# EAGLE design esquematicov2 (EAGLE 7.1.0)
Teste
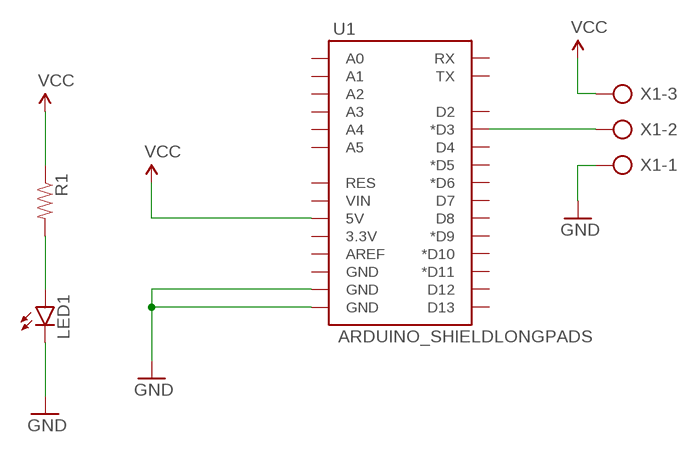
[diagram p0: schematic, sheet 1]

## Parts
LED1  LED5MM  [LED5MM]
R1  RESISTORPTH-1/4W-VERT  [AXIAL-0.1]
U1  ARDUINO_SHIELDLONGPADS  [DUEMILANOVE_SHIELD_LONGPADS]
X1  AK500/3-H  [AK500/3-H]

## Nets
GND: LED1.K(C) U1.GND@0(GND) U1.GND@1(GND) X1.1
N$1: LED1.A R1.P$2
N$2: U1.D3(*D3) X1.2
VCC: R1.P$1 U1.5V X1.3
Unconnected: U1.3.3V U1.A0 U1.A1 U1.A2 U1.A3 U1.A4 U1.A5 U1.AREF U1.D2 U1.D4 U1.D5(*D5) U1.D6(*D6) U1.D7 U1.D8 U1.D9(*D9) U1.D10(*D10) U1.D11(*D11) U1.D12 U1.D13 U1.GND@2(GND) U1.RES U1.RX U1.TX U1.VIN

## Library data of the parts
LED1 = SparkFun-LED:LED: LEDs Standard schematic elements and footprints for 5mm, 3mm, 1206, and 0603 sized LEDs. 5mm - Spark Fun Electronics SKU : COM-00529 (and others)
R1 = SparkFun-Resistors:RESISTOR: Resistor Basic schematic elements and footprints for 0603, 1206, and PTH resistors.
U1 = SparkFun-Boards:ARDUINO_SHIELD: Arduino shield footprint
X1 = con-ptr500:AK500/3-H: CONNECTOR Aug. 2004 / PTR Meßtechnik: Die Bezeichnung der Serie AK505 wurde geändert. Es handelt sich hierbei um AK500 in horizontaler Ausführung.; OC_FARNELL: unknown; OC_NEWARK: unknown

## Board
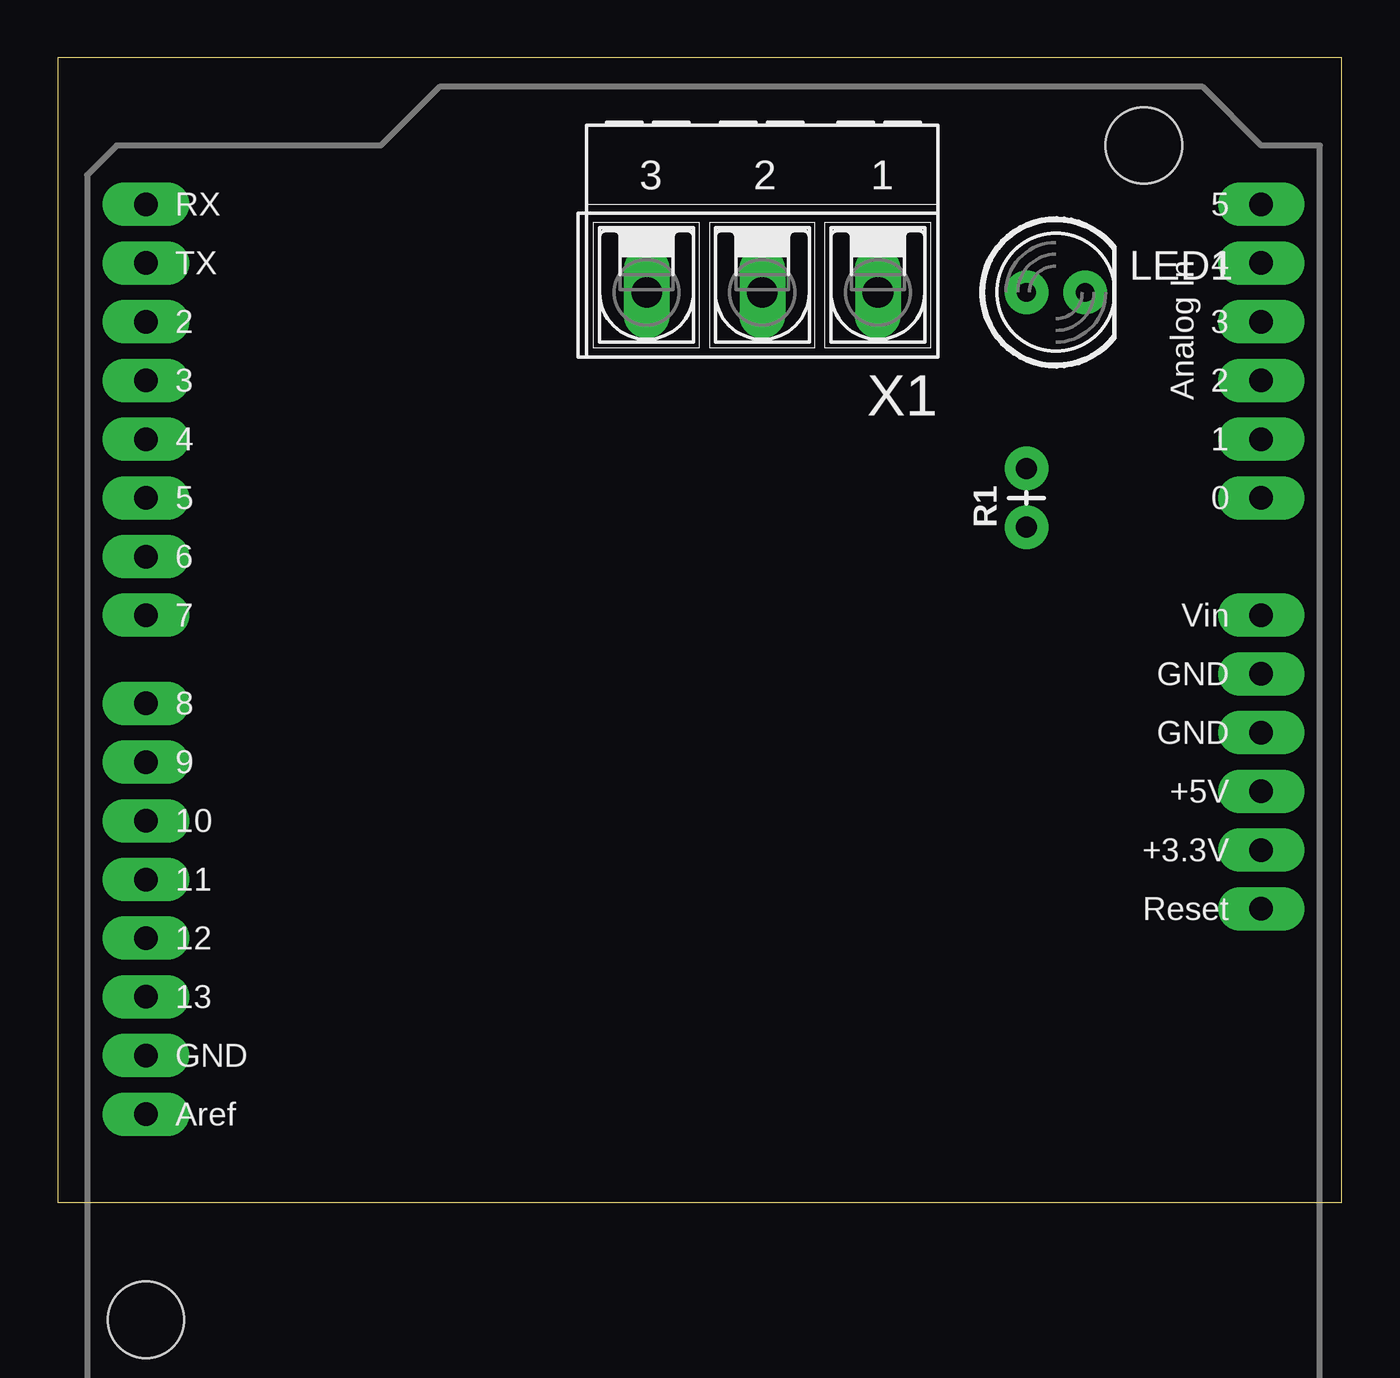
[diagram p1: board, top side]
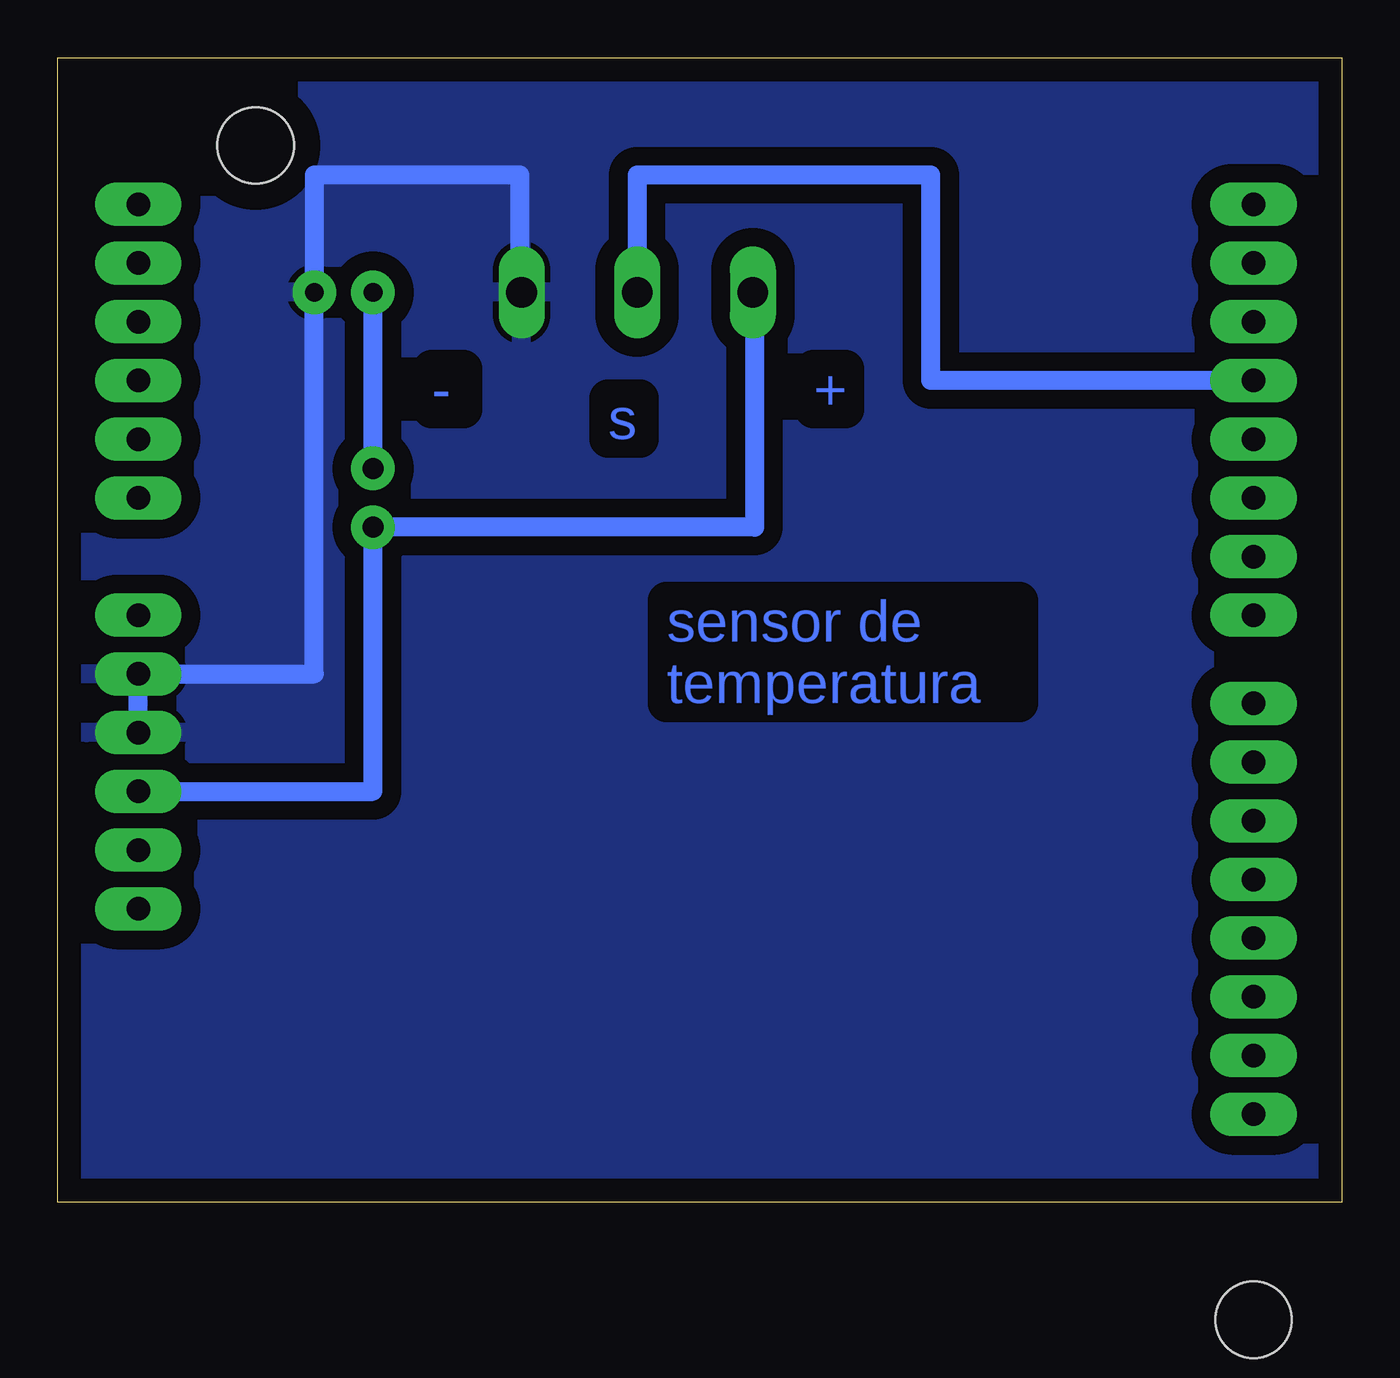
[diagram p2: board, bottom side, seen from below]

Size 55.55 x 49.52 mm. Coordinates in mm from the lower left corner, seen from the top.
Outline: 0,0 55.55,0 55.55,49.52 0,49.52 0,0
Copper layers (1*16): Top 0.035mm / dielectric 1.5mm / Bottom 0.035mm
Design rules "default": minimum track width 10mil, minimum drill 24mil, track to track 8mil, track to pad 8mil, pad to pad 8mil, via to via 8mil, smd to smd 8mil, copper to edge 40mil, drill to drill 8mil, minimum pad ring 10mil, minimum via ring 8mil, stop-mask expansion 4mil, vias tented up to drill 0mil, thermal gap 10mil

### Footprints (pad centres in the part's own frame; a part is rotated, then mirrored left to right if it is on the bottom)
LED5MM = drill 0.813 pad 1.88: A -1.27,0; K 1.27,0
AXIAL-0.1 = drill 0.9 pad 1.88: P$1 0,0; P$2 2.54,0
DUEMILANOVE_SHIELD_LONGPADS = drill 1.016 pad 1.88 long: 3.3V 50.8,26.67; 5V 50.8,29.21; A0 50.8,41.91; A1 50.8,44.45; A2 50.8,46.99; A3 50.8,49.53; A4 50.8,52.07; A5 50.8,54.61; AREF 2.54,15.24; D2 2.54,49.53; D3 2.54,46.99; D4 2.54,44.45; D5 2.54,41.91; D6 2.54,39.37; D7 2.54,36.83; D8 2.54,33.02; D9 2.54,30.48; D10 2.54,27.94; D11 2.54,25.4; D12 2.54,22.86; D13 2.54,20.32; GND@0 50.8,31.75; GND@1 50.8,34.29; GND@2 2.54,17.78; RES 50.8,24.13; RX 2.54,54.61; TX 2.54,52.07; VIN 50.8,36.83 | hole 3.302: 45.72,57.15; 2.54,6.35
AK500/3-H = drill 1.321 long: 1 -5.004,0; 2 0,0; 3 5.004,0

### Placement (x,y rotation side)
LED1  43.18,39.37 0 top
R1  41.91,29.21 90 top
U1  1.27,-11.43 0 top
X1  30.48,39.37 180 top

### Tracks (layer width: path | path; a pad name or v marks a point on that pad's centre or on a via)
GND
  Bottom 0.813: X1.1 35.56,39.37 35.56,44.45 44.45,44.45 LED1.K 44.45,22.86 U1.GND@1 U1.GND@0
  pour Bottom (isolate 0.813): 0,49.53 55.88,49.53 55.88,0 0,0
N$1
  Bottom 0.813: R1.P$2 LED1.A
N$2
  Bottom 0.813: U1.D3 17.78,35.56 17.78,44.45 30.48,44.45 X1.2
VCC
  Bottom 0.813: U1.5V 41.91,17.78 R1.P$1 25.4,29.21 25.4,39.37 X1.3

### Text on the board
Bottom: + | - | - | s | sensor de / temperatura